# EAGLE design bbb-audiocape (EAGLE 6.1)
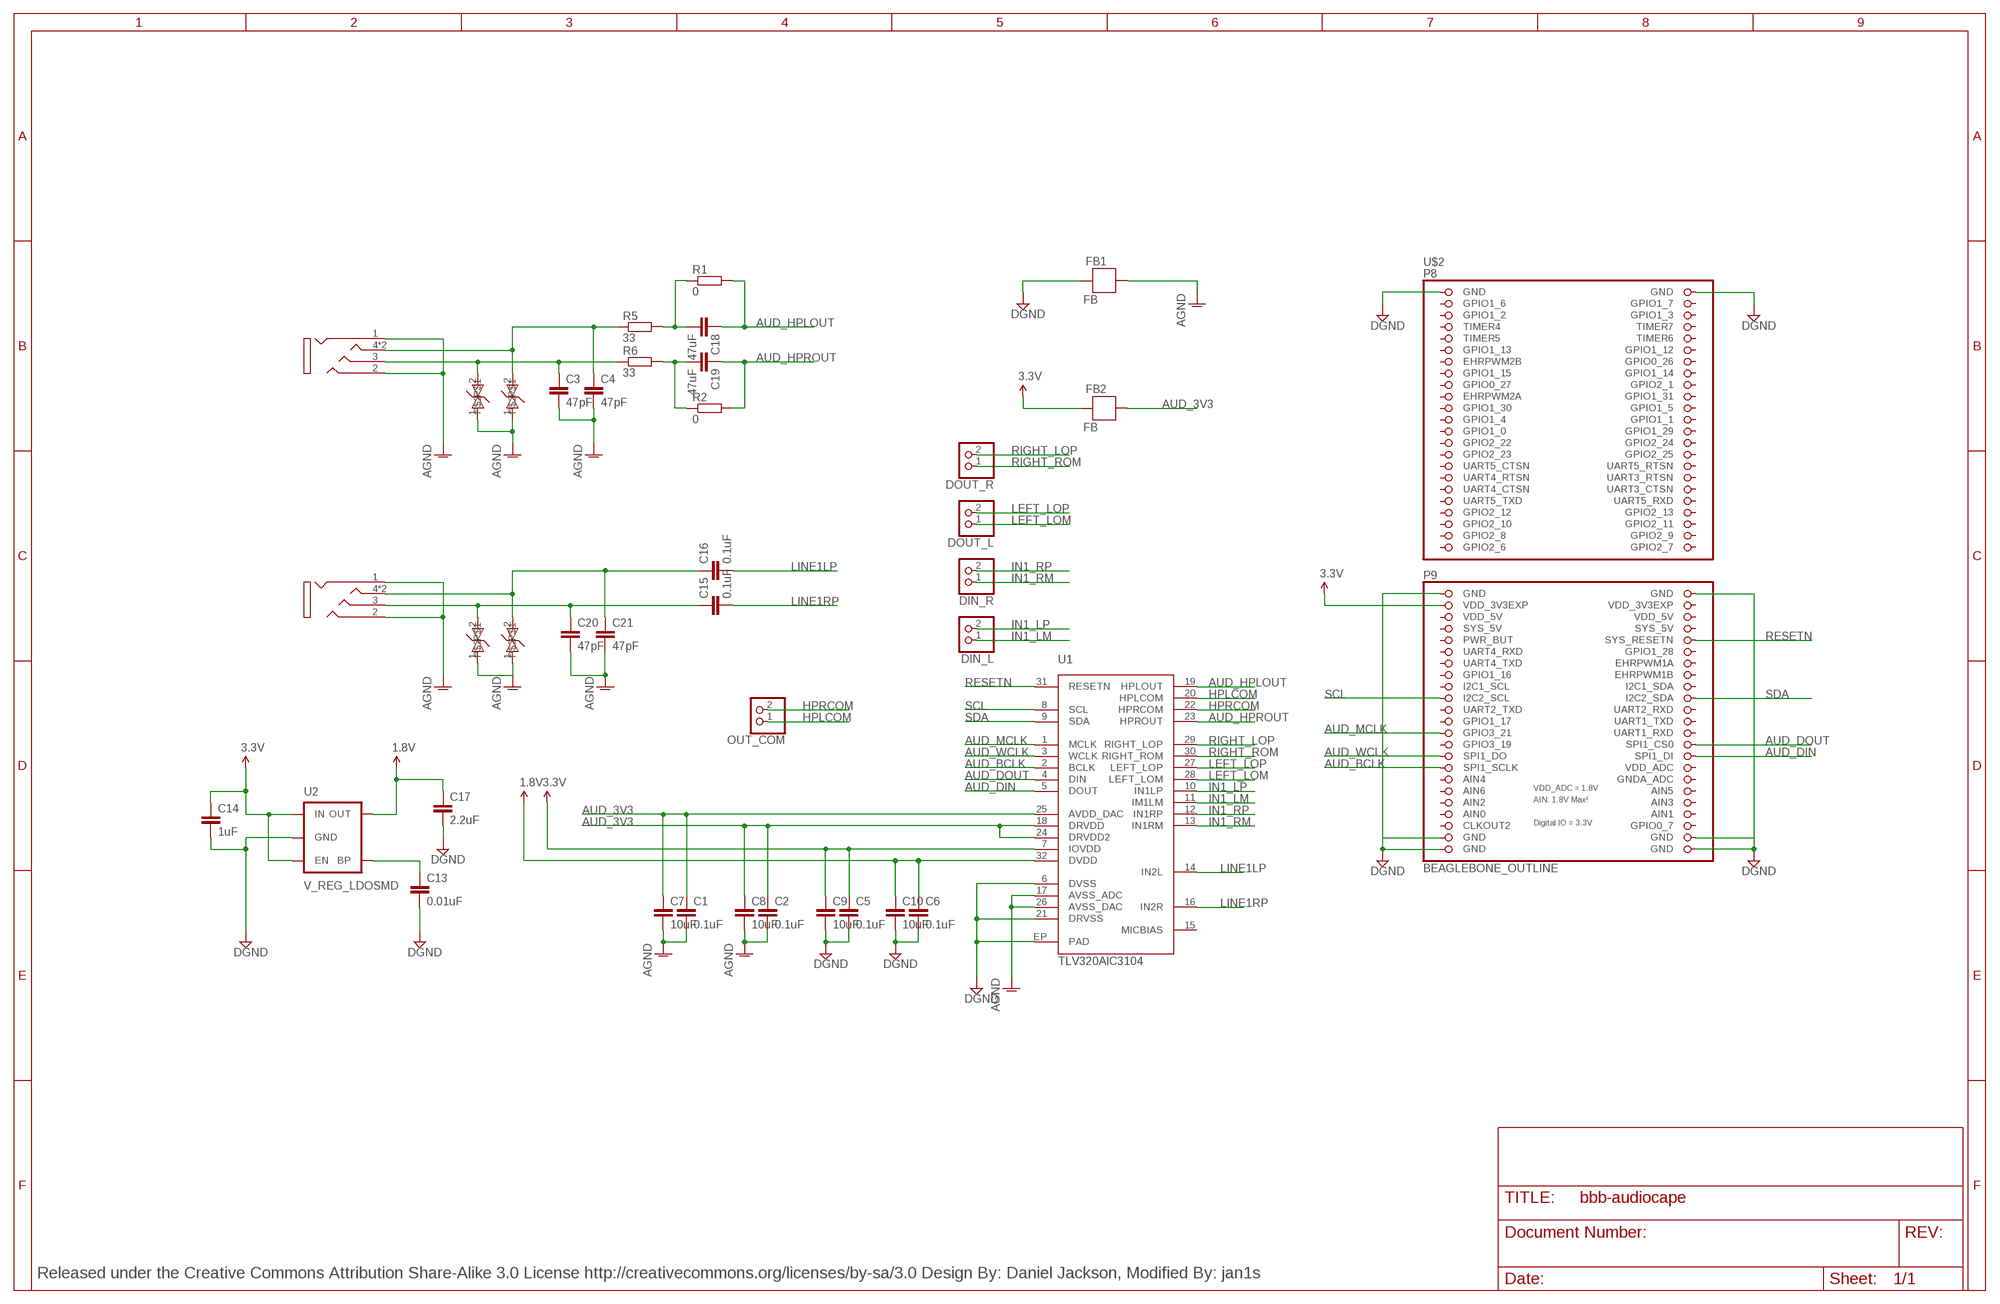
[diagram p0: schematic, sheet 1]

## Parts
C1  0.1uF  C-EUC0603  [C0603]
C2  0.1uF  C-EUC0603  [C0603]
C3  47pF  C-EUC0603  [C0603]
C4  47pF  C-EUC0603  [C0603]
C5  0.1uF  C-EUC0603  [C0603]
C6  0.1uF  C-EUC0603  [C0603]
C7  10uF  C-EUC0603  [C0603]
C8  10uF  C-EUC0603  [C0603]
C9  10uF  C-EUC0603  [C0603]
C10  10uF  C-EUC0603  [C0603]
C13  0.01uF  C-EUC0603  [C0603]
C14  1uF  C-EUC0603  [C0603]
C15  0.1uF  C-EUC0603  [C0603]
C16  0.1uF  C-EUC0603  [C0603]
C17  2.2uF  C-EUC0603  [C0603]
C18  47uF  C-EUC1206  [C1206]
C19  47uF  C-EUC1206  [C1206]
C20  47pF  C-EUC0603  [C0603]
C21  47pF  C-EUC0603  [C0603]
D1  PGB0010603MR  [0603]
D2  PGB0010603MR  [0603]
D3  PGB0010603MR  [0603]
D4  PGB0010603MR  [0603]
DIN_L  HEADER-1X2ROUND  [1X02_ROUND]
DIN_R  HEADER-1X2ROUND  [1X02_ROUND]
DOUT_L  HEADER-1X2ROUND  [1X02_ROUND]
DOUT_R  HEADER-1X2ROUND  [1X02_ROUND]
FB1  FB  [0603]
FB2  FB  [0603]
OUT_COM  HEADER-1X2ROUND  [1X02_ROUND]
R1  0  R-EU_R0603  [R0603]
R2  0  R-EU_R0603  [R0603]
R5  33  R-EU_R0603  [R0603]
R6  33  R-EU_R0603  [R0603]
U1  TLV320AIC3104  [QFN-32]
U2  V_REG_LDOSMD  [SOT23-5]
U$2  BEAGLEBONE_OUTLINE  [BEAGLEBONE_SHIELD]
U$3  1503_13  [1503-03]
U$5  1503_13  [1503-03]

## Nets
1.8V: C6.1 C10.1 C17.1 U1.32(DVDD) U2.5(OUT)
3.3V: C5.1 C9.1 C14.1 FB2.2 U1.7(IOVDD) U2.1(IN) U2.3(EN) U$2.49(VDD_3V3EXP)
AGND: C1.2 C2.2 C3.2 C4.2 C7.2 C8.2 C20.2 C21.2 D1.1 D2.1 D3.1 D4.1 FB1.1 U1.17(AVSS_ADC) U1.26(AVSS_DAC) U$3.1 U$3.2 U$5.1 U$5.2
AUD_3V3: C1.1 C2.1 C7.1 C8.1 FB2.1 U1.18(DRVDD) U1.24(DRVDD2) U1.25(AVDD_DAC)
AUD_BCLK: U1.2(BCLK) U$2.77(SPI1_SCLK)
AUD_DIN: U1.5(DOUT) U$2.76(SPI1_DI)
AUD_DOUT: U1.4(DIN) U$2.74(SPI1_CS0)
AUD_HPLOUT: C18.1 R1.2 U1.19(HPLOUT)
AUD_HPROUT: C19.1 R2.2 U1.23(HPROUT)
AUD_MCLK: U1.1(MCLK) U$2.71(GPIO3_21)
AUD_WCLK: U1.3(WCLK) U$2.75(SPI1_DO)
DGND: C5.2 C6.2 C9.2 C10.2 C13.2 C14.2 C17.2 FB1.2 U1.6(DVSS) U1.21(DRVSS) U1.EP(PAD) U2.2(GND) U$2.1(GND) U$2.2(GND) U$2.47(GND) U$2.48(GND) U$2.89(GND) U$2.90(GND) U$2.91(GND) U$2.92(GND)
HPLCOM: OUT_COM.1 U1.20(HPLCOM)
HPRCOM: OUT_COM.2 U1.22(HPRCOM)
IN1_LM: DIN_L.1 U1.11(IM1LM)
IN1_LP: DIN_L.2 U1.10(IN1LP)
IN1_RM: DIN_R.1 U1.13(IN1RM)
IN1_RP: DIN_R.2 U1.12(IN1RP)
J1: C4.1 D2.2 R5.1 U$3.4 U$3.4-2
LEFT_LOM: DOUT_L.1 U1.28(LEFT_LOM)
LEFT_LOP: DOUT_L.2 U1.27(LEFT_LOP)
LINE1LP: C16.2 U1.14(IN2L)
LINE1RP: C15.2 U1.16(IN2R)
N$1: C15.1 C20.1 D3.2 U$5.3
N$3: C18.2 R1.1 R5.2
N$4: C19.2 R2.1 R6.2
N$5: C3.1 D1.2 R6.1 U$3.3
N$6: C16.1 C21.1 D4.2 U$5.4 U$5.4-2
N$7: C13.1 U2.4(BP)
RESETN: U1.31(RESETN) U$2.56(SYS_RESETN)
RIGHT_LOP: DOUT_R.2 U1.29(RIGHT_LOP)
RIGHT_ROM: DOUT_R.1 U1.30(RIGHT_ROM)
SCL: U1.8(SCL) U$2.65(I2C2_SCL)
SDA: U1.9(SDA) U$2.66(I2C2_SDA)
Unconnected: U1.15(MICBIAS) U$2.3(GPIO1_6) U$2.4(GPIO1_7) U$2.5(GPIO1_2) U$2.6(GPIO1_3) U$2.7(TIMER4) U$2.8(TIMER7) U$2.9(TIMER5) U$2.10(TIMER6) U$2.11(GPIO1_13) U$2.12(GPIO1_12) U$2.13(EHRPWM2B) U$2.14(GPIO0_26) U$2.15(GPIO1_15) U$2.16(GPIO1_14) U$2.17(GPIO0_27) U$2.18(GPIO2_1) U$2.19(EHRPWM2A) U$2.20(GPIO1_31) U$2.21(GPIO1_30) U$2.22(GPIO1_5) U$2.23(GPIO1_4) U$2.24(GPIO1_1) U$2.25(GPIO1_0) U$2.26(GPIO1_29) U$2.27(GPIO2_22) U$2.28(GPIO2_24) U$2.29(GPIO2_23) U$2.30(GPIO2_25) U$2.31(UART5_CTSN) U$2.32(UART5_RTSN) U$2.33(UART4_RTSN) U$2.34(UART3_RTSN) U$2.35(UART4_CTSN) U$2.36(UART3_CTSN) U$2.37(UART5_TXD) U$2.38(UART5_RXD) U$2.39(GPIO2_12) U$2.40(GPIO2_13) U$2.41(GPIO2_10) U$2.42(GPIO2_11) U$2.43(GPIO2_8) U$2.44(GPIO2_9) U$2.45(GPIO2_6) U$2.46(GPIO2_7) U$2.55(PWR_BUT) U$2.57(UART4_RXD) U$2.58(GPIO1_28) U$2.59(UART4_TXD) U$2.60(EHRPWM1A) U$2.61(GPIO1_16) U$2.62(EHRPWM1B) U$2.63(I2C1_SCL) U$2.64(I2C1_SDA) U$2.67(UART2_TXD) U$2.68(UART2_RXD) U$2.69(GPIO1_17) U$2.70(UART1_TXD) U$2.72(UART1_RXD) U$2.73(GPIO3_19) U$2.79(AIN4) U$2.81(AIN6) U$2.82(AIN5) U$2.83(AIN2) U$2.84(AIN3) U$2.85(AIN0) U$2.86(AIN1) U$2.87(CLKOUT2) U$2.88(GPIO0_7)

## Notes on the sheet
- Released under the Creative Commons Attribution Share-Alike 3.0 License http://creativecommons.org/licenses/by-sa/3.0 Design By: Daniel Jackson, Modified By: jan1s

## Power pins joined to a net without a drawn wire
GNDA_ADC: U$2.80(GNDA_ADC)
SYS_5V: U$2.53(SYS_5V) U$2.54(SYS_5V)
VDD_3V3EXP: U$2.50(VDD_3V3EXP)
VDD_5V: U$2.51(VDD_5V) U$2.52(VDD_5V)
VDD_ADC: U$2.78(VDD_ADC)

## Library data of the parts
C1-C10 C13-C21 = rcl:C-EU: CAPACITOR, European symbol
D1-D4 = CircuitCo:PGB0010603MR; MANEX: 130-0001371
DIN_L DIN_R DOUT_L DOUT_R OUT_COM = microbuilder:HEADER-1X2: PIN HEADER
FB1 FB2 = SparkFun-Passives:FB; MANEX: 126-0001418
R1 R2 R5 R6 = rcl:R-EU_: RESISTOR, European symbol
U1 = CircuitCo:TLV320AIC3104; MANEX: 140-0004277
U2 = SparkFun-PowerIC:V_REG_LDO: Voltage Regulator LDO Standard 150mA LDO voltage regulator in SOT-23 layout. Micrel part MIC5205. BP (by-pass) pin is used to lower output noise with 470pF cap.; MANEX: 140-0001616
U$2 = microbuilder:BEAGLEBONE_OUTLINE
U$3 U$5 = con-lumberg:1503_13

## Board
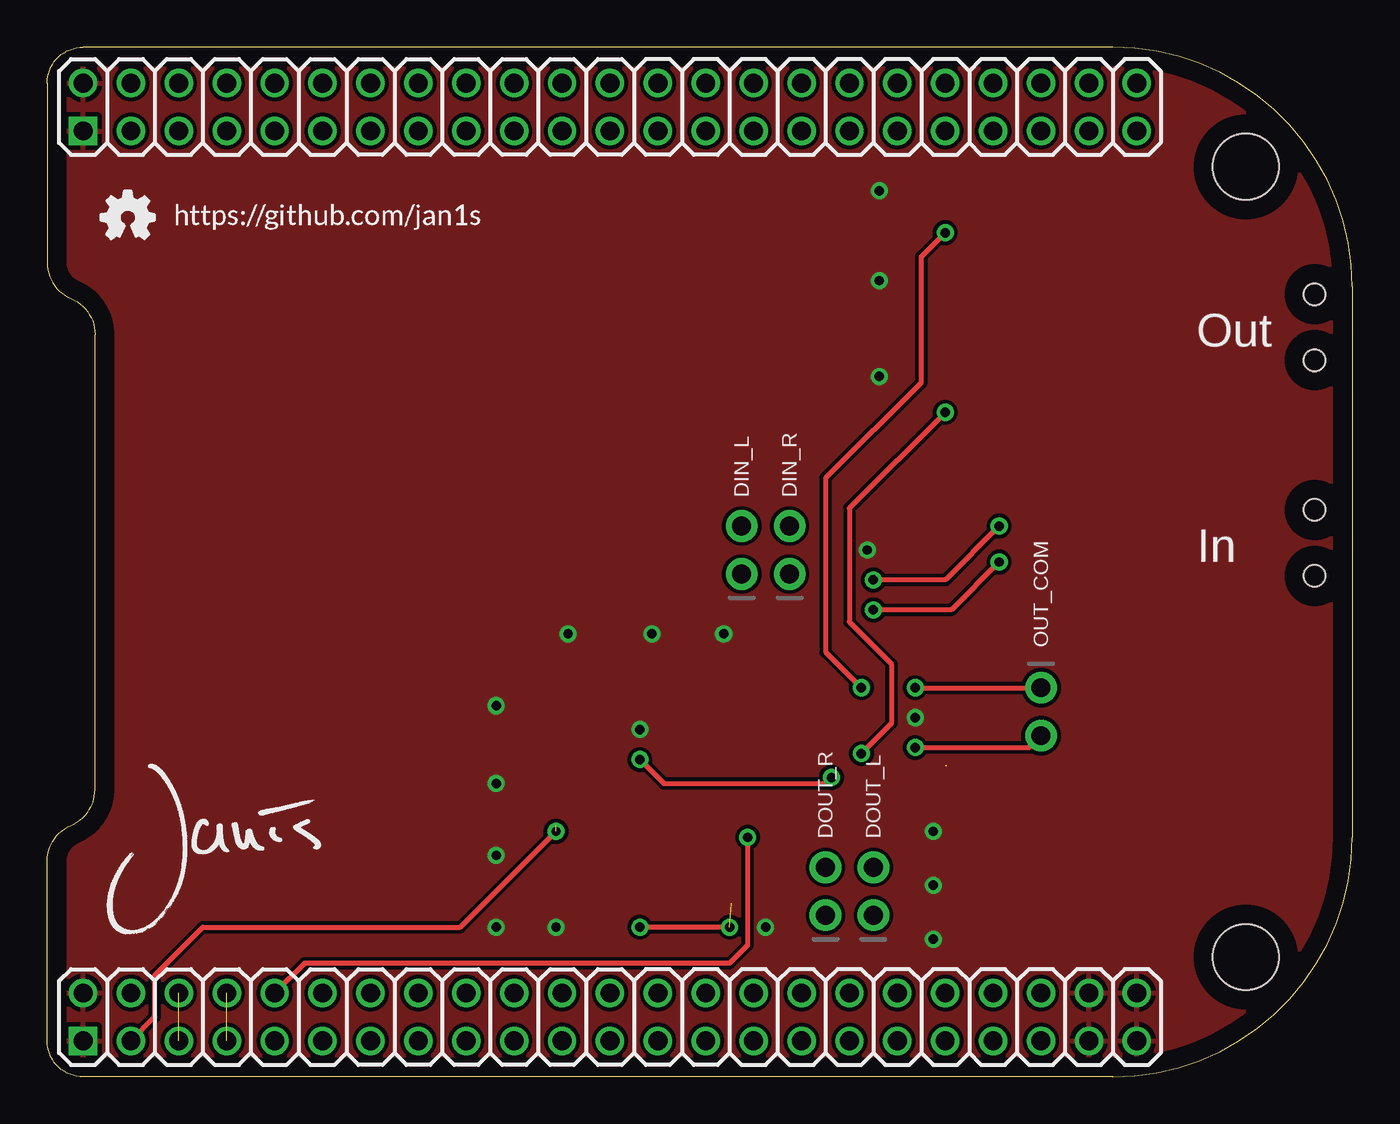
[diagram p1: board, top side]
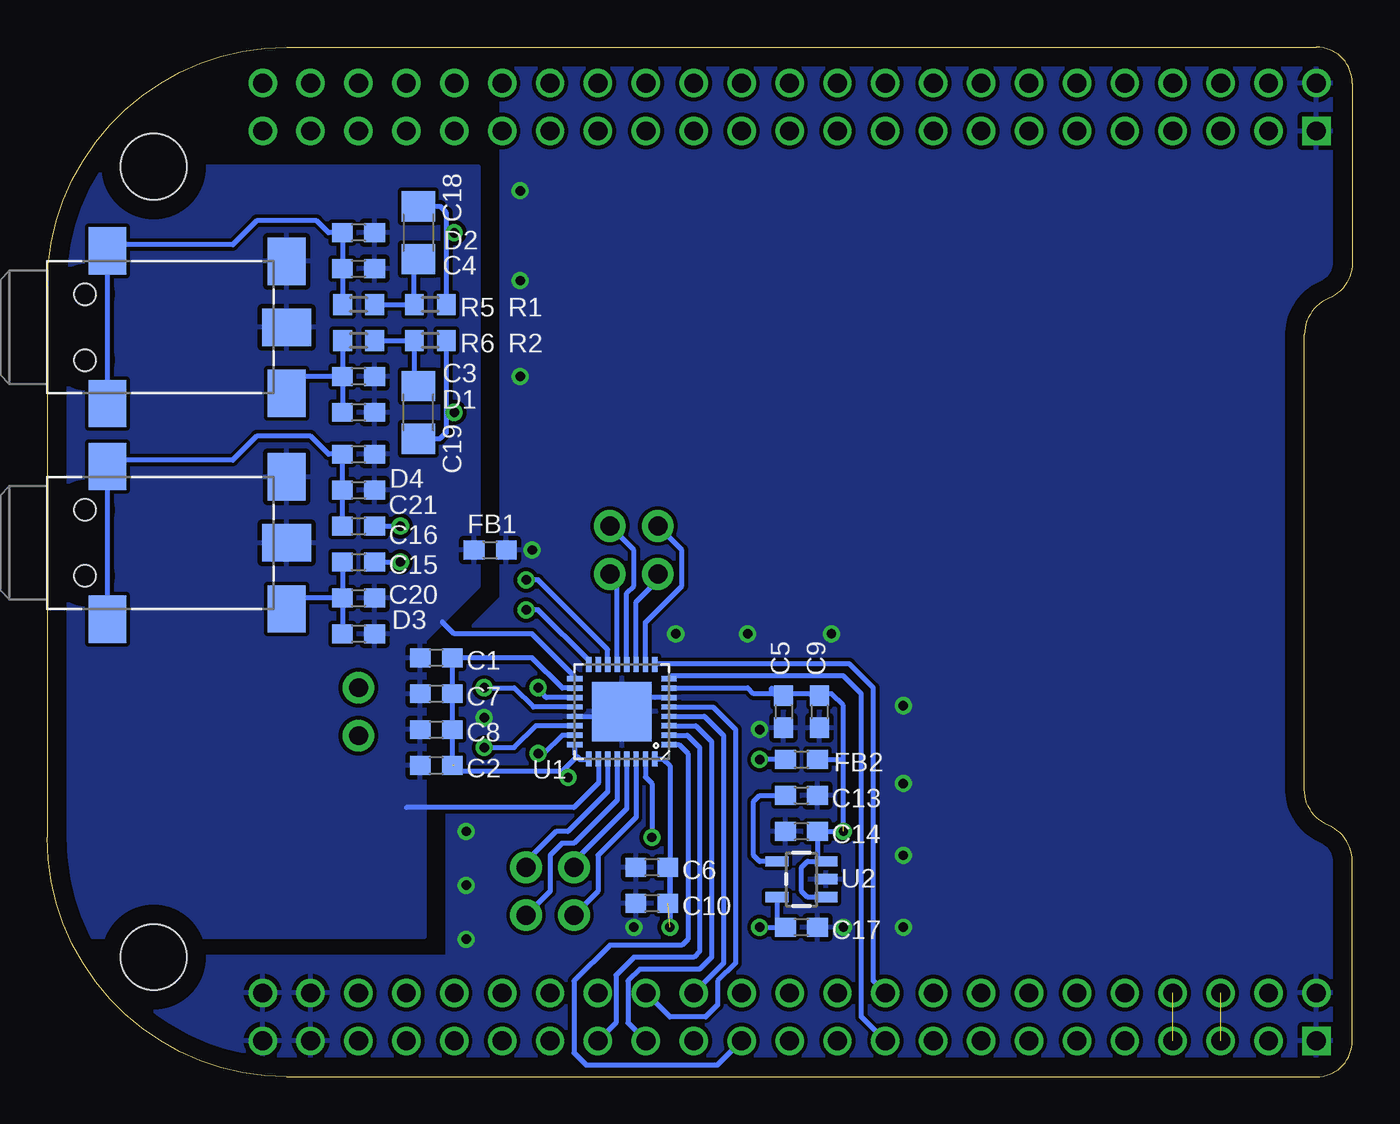
[diagram p2: board, bottom side, seen from below]

Size 69.22 x 54.61 mm. Coordinates in mm from the lower left corner, seen from the top.
Copper layers (1*16): Top 0.035mm / dielectric 1.5mm / Bottom 0.035mm
Design rules: minimum track width 10mil, minimum drill 24mil, track to track 8mil, track to pad 8mil, pad to pad 8mil, via to via 8mil, smd to smd 8mil, copper to edge 40mil, drill to drill 8mil, minimum pad ring 10mil, minimum via ring 8mil, stop-mask expansion 4mil, vias tented up to drill 0mil, thermal gap 10mil

### Footprints (pad centres in the part's own frame; a part is rotated, then mirrored left to right if it is on the bottom)
C0603 = smd 1.1 x 1: 1 -0.85,0; 2 0.85,0
C1206 = smd 1.6 x 1.8: 1 -1.4,0; 2 1.4,0
0603 = smd 1.1 x 1: 1 -0.85,0; 2 0.85,0
1X02_ROUND = drill 1 pad 1.676: 1 -1.27,0; 2 1.27,0
R0603 = smd 1 x 1.1: 1 -0.85,0; 2 0.85,0
QFN-32 = smd 0.285 x 0.8: 1 -1.75,-2.5; 2 -1.25,-2.5; 3 -0.75,-2.5; 4 -0.25,-2.5; 5 0.25,-2.5; 6 0.75,-2.5; 7 1.25,-2.5; 8 1.75,-2.5; 17 1.75,2.5; 18 1.25,2.5; 19 0.75,2.5; 20 0.25,2.5; 21 -0.25,2.5; 22 -0.75,2.5; 23 -1.25,2.5; 24 -1.75,2.5 | smd 0.8 x 0.285: 9 2.5,-1.75; 10 2.5,-1.25; 11 2.5,-0.75; 12 2.5,-0.25; 13 2.5,0.25; 14 2.5,0.75; 15 2.5,1.25; 16 2.5,1.75; 25 -2.5,1.75; 26 -2.5,1.25; 27 -2.5,0.75; 28 -2.5,0.25; 29 -2.5,-0.25; 30 -2.5,-0.75; 31 -2.5,-1.25; 32 -2.5,-1.75 | smd 3.15 x 3.15: EP 0,0
SOT23-5 = smd 0.55 x 1.2: 1 -0.95,-1.3; 2 0,-1.3; 3 0.95,-1.3; 4 0.95,1.3; 5 -0.95,1.3
BEAGLEBONE_SHIELD = drill 1 square: 1 4.445,19.05; 47 52.705,19.05 | drill 1: 2 1.905,19.05; 3 4.445,21.59; 4 1.905,21.59; 5 4.445,24.13; 6 1.905,24.13; 7 4.445,26.67; 8 1.905,26.67; 9 4.445,29.21; 10 1.905,29.21; 11 4.445,31.75; 12 1.905,31.75; 13 4.445,34.29; 14 1.905,34.29; 15 4.445,36.83; 16 1.905,36.83; 17 4.445,39.37; 18 1.905,39.37; 19 4.445,41.91; 20 1.905,41.91; 21 4.445,44.45; 22 1.905,44.45; 23 4.445,46.99; 24 1.905,46.99; 25 4.445,49.53; 26 1.905,49.53; 27 4.445,52.07; 28 1.905,52.07; 29 4.445,54.61; 30 1.905,54.61; 31 4.445,57.15; 32 1.905,57.15; 33 4.445,59.69; 34 1.905,59.69; 35 4.445,62.23; 36 1.905,62.23; 37 4.445,64.77; 38 1.905,64.77; 39 4.445,67.31; 40 1.905,67.31; 41 4.445,69.85; 42 1.905,69.85; 43 4.445,72.39; 44 1.905,72.39; 45 4.445,74.93; 46 1.905,74.93; 48 50.165,19.05; 49 52.705,21.59; 50 50.165,21.59; 51 52.705,24.13; 52 50.165,24.13; 53 52.705,26.67; 54 50.165,26.67; 55 52.705,29.21; 56 50.165,29.21; 57 52.705,31.75; 58 50.165,31.75; 59 52.705,34.29; 60 50.165,34.29; 61 52.705,36.83; 62 50.165,36.83; 63 52.705,39.37; 64 50.165,39.37; 65 52.705,41.91; 66 50.165,41.91; 67 52.705,44.45; 68 50.165,44.45; 69 52.705,46.99; 70 50.165,46.99; 71 52.705,49.53; 72 50.165,49.53; 73 52.705,52.07; 74 50.165,52.07; 75 52.705,54.61; 76 50.165,54.61; 77 52.705,57.15; 78 50.165,57.15; 79 52.705,59.69; 80 50.165,59.69; 81 52.705,62.23; 82 50.165,62.23; 83 52.705,64.77; 84 50.165,64.77; 85 52.705,67.31; 86 50.165,67.31; 87 52.705,69.85; 88 50.165,69.85; 89 52.705,72.39; 90 50.165,72.39; 91 52.705,74.93; 92 50.165,74.93 | hole 3.5: 6.35,80.71; 48.26,80.71
1503-03 = smd 2.6 x 2: 1 12.7,0 | smd 2 x 2.5: 2 12.7,3.5; 3 12.7,-3.5; 4 3.2,4.05; 4-2 3.2,-4.05 | hole 1.15: 2,-1.75; 2,1.75

### Placement (x,y rotation side)
C1  48.58,22.22 180 bottom
C2  48.58,16.51 180 bottom
C3  52.71,37.15 0 bottom
C4  52.71,42.86 0 bottom
C5  30.16,19.37 270 bottom
C6  37.15,11.11 180 bottom
C7  48.58,20.32 180 bottom
C8  48.58,18.41 180 bottom
C9  28.26,19.37 270 bottom
C10  37.15,9.21 180 bottom
C13  29.21,14.92 0 bottom
C14  29.21,13.02 180 bottom
C15  52.71,27.3 0 bottom
C16  52.71,29.21 0 bottom
C17  29.21,7.94 0 bottom
C18  49.53,44.77 270 bottom
C19  49.53,35.24 90 bottom
C20  52.71,25.4 0 bottom
C21  52.71,31.11 0 bottom
D1  52.71,35.24 180 bottom
D2  52.71,44.77 180 bottom
D3  52.71,23.49 180 bottom
D4  52.71,33.02 180 bottom
DIN_L  36.83,27.94 90 top
DIN_R  39.37,27.94 90 top
DOUT_L  43.81,9.84 90 top
DOUT_R  41.27,9.84 90 top
FB1  45.72,27.94 0 bottom
FB2  29.21,16.83 0 bottom
OUT_COM  52.71,19.37 270 top
R1  48.9,40.96 0 bottom
R2  48.9,39.05 0 bottom
R5  52.71,40.96 0 bottom
R6  52.71,39.05 0 bottom
U1  38.73,19.37 90 bottom
U2  29.21,10.48 90 bottom
U$1  [GITHUB/JAN1S]  6.67,45.08 0 top
U$2  -17.14,54.61 270 top
U$3  69.22,39.75 0 bottom
U$4  [JANIS_10MM]  2.86,7.3 0 top
U$5  69.22,28.32 0 bottom
U$6  [OSHW_FILLX100_NOTEXT]  2.86,44.45 0 top

### Tracks (layer width: path | path; a pad name or v marks a point on that pad's centre or on a via)
1.8V  (via drill 0.5)  (1 unrouted)
  Top 0.254: v36.2,7.94 v31.43,7.94
  Bottom 0.254: 36.51,11.11 C6.1 36.2,11.01 36.2,9.21 C10.1 | U1.32 36.55,16.87 36.2,16.51 v36.2,7.94 | v31.43,7.94 C17.1 30.51,8.39 U2.5
3.3V  (via drill 0.5)  (1 unrouted)
  Top 0.254: U$2.49 5.71,3.17 5.71,5.4 8.26,7.94 21.91,7.94 v26.99,13.02
  Bottom 0.254: 30.8,20.32 30.8,20.62 | 28.26,11.43 28.89,11.43 29.21,11.11 29.21,9.84 28.9,9.53 U2.1 | 27.94,11.43 U2.3 27.94,11.43 | 28.26,11.43 28.36,11.53 C14.1 27.3,13.02 26.99,13.33 26.99,16.83 | 28.26,11.43 27.94,11.43 | 26.99,16.83 26.99,19.68 27.62,20.32 28.79,20.32 C9.1 28.89,20.32 30.7,20.32 C5.1 30.8,20.32 | 30.8,20.32 31.75,20.32 32.05,20.62 | 32.05,20.62 32.07,20.64 | U1.7 32.05,20.62 | FB2.2 26.99,16.83
AGND
  Bottom 0.254: U1.17 41.23,21.23 43.5,23.49 47.63,23.49 48.26,24.13 | U1.26 39.98,15.58 41.27,14.29 50.16,14.29
  pour Bottom: 46.35,48.26 46.35,26.03 49.21,23.18 49.21,7.43 69.22,7.43 69.22,48.26
AUD_3V3  (via drill 0.5)  (1 unrouted)
  Top 0.254: v31.43,16.83 32.7,15.56 41.27,15.56 v41.59,15.87
  Bottom 0.254: U1.24 41.23,17.1 41.12,16.99 | 41.12,16.99 40.96,16.83 40.52,16.83 U1.25 | 41.91,16.19 41.12,16.99 | C2.1 C8.1 C7.1 C1.1 43.5,22.22 41.89,20.62 U1.18 | 41.91,16.19 47.31,16.19 47.63,16.51 | FB2.1 v31.43,16.83 | v41.59,15.87 41.91,16.19
AUD_BCLK
  Bottom 0.254: U1.2 35.26,18.12 34.61,17.46 34.61,6.67 34.93,6.35 38.1,6.35 39.05,5.4 39.05,2.86 U$2.77
AUD_DIN
  Bottom 0.254: U1.5 33.91,19.62 32.7,18.41 32.7,6.03 33.66,5.08 33.66,3.81 34.29,3.17 36.2,3.17 U$2.76
AUD_DOUT
  Bottom 0.254: U1.4 34.36,19.12 33.34,18.1 33.34,6.03 U$2.74
AUD_HPLOUT  (via drill 0.5)
  Top 0.254: v47.63,44.77 46.35,43.5 46.35,36.83 41.27,31.75 41.27,22.54 v43.18,20.64
  Bottom 0.254: R1.2 48.04,44.77 | 48.04,44.77 48.04,45.82 48.39,46.17 C18.1 | v47.63,44.77 48.04,44.77 | U1.19 42.75,20.12 v43.18,20.64
AUD_HPROUT  (via drill 0.5)
  Top 0.254: v47.63,35.24 42.55,30.16 42.55,24.13 44.77,21.91 44.77,18.73 v43.18,17.14
  Bottom 0.254: C19.1 48.39,33.84 48.04,34.19 48.04,35.24 | 48.04,35.24 R2.2 | v47.63,35.24 48.04,35.24 | U1.23 41.89,18.12 42.86,17.14 v43.18,17.14
AUD_MCLK
  Bottom 0.254: U1.1 35.72,17.62 35.24,17.14 35.24,7.3 35.56,6.98 39.37,6.98 41.27,5.08 41.27,1.27 40.64,0.63 33.66,0.63 U$2.71
AUD_WCLK
  Bottom 0.254: U1.3 34.81,18.62 33.97,17.78 33.97,6.35 34.61,5.71 37.78,5.71 38.42,5.08 38.42,2.86 U$2.75
DGND  (via drill 0.5)
  Bottom 0.254: U1.6 37.98,20.12 U1.EP 38.98,19.12 U1.21
  other vias: 46.04,19.05 26.99,7.94 31.43,18.41 38.1,7.94 43.5,27.94 35.88,23.49 46.99,13.02 46.99,7.3 46.99,10.16 44.13,37.15 44.13,46.99 44.13,42.23 32.07,23.49 27.62,23.49 23.81,19.68 23.81,15.56 23.81,11.75 23.81,7.94
  pour Top: -3.17,57.15 -3.17,-2.54 73.03,-2.54 73.03,57.15
  pour Bottom: -1.9,-3.81 47.94,-3.81 47.94,22.54 45.09,25.4 45.09,58.42 -1.9,58.42
  pour Bottom: 44.13,6.35 69.22,6.35 69.22,-6.35 44.13,-6.35
HPLCOM  (via drill 0.5)
  Top 0.254: v46.04,20.64 OUT_COM.1
  Bottom 0.254: U1.20 43.43,19.62 44.45,20.64 v46.04,20.64
HPRCOM  (via drill 0.5)
  Top 0.254: v46.04,17.46 52.07,17.46 OUT_COM.2
  Bottom 0.254: U1.22 43.3,18.62 44.45,17.46 v46.04,17.46
IN1_LM
  Bottom 0.254: U1.11 37.98,25.2 36.83,26.35 DIN_L.1
IN1_LP
  Bottom 0.254: U1.10 37.48,24.11 35.56,26.03 35.56,27.94 DIN_L.2
IN1_RM
  Bottom 0.254: U1.13 38.98,26.28 DIN_R.1
IN1_RP
  Bottom 0.254: U1.12 38.48,25.65 38.1,26.03 38.1,27.94 DIN_R.2
J1
  Bottom 0.254: R5.1 C4.1 D2.2 54.29,44.77 54.93,45.4 58.1,45.4 59.37,44.13 65.68,44.13 U$3.4 U$3.4-2
LEFT_LOM
  Bottom 0.254: U1.28 38.98,14.67 41.27,12.38 41.91,12.38 42.55,11.75 42.55,9.84 DOUT_L.1
LEFT_LOP
  Bottom 0.254: U1.27 39.48,15.12 41.59,13.02 42.23,13.02 43.81,11.43 DOUT_L.2
LINE1LP  (via drill 0.5)
  Top 0.254: v50.48,29.21 47.63,26.35 v43.81,26.35
  Bottom 0.254: C16.2 v50.48,29.21 | U1.14 39.48,22.66 43.18,26.35 v43.81,26.35
LINE1RP  (via drill 0.5)
  Top 0.254: v50.48,27.3 47.94,24.76 v43.81,24.76
  Bottom 0.254: C15.2 v50.48,27.3 | U1.16 40.48,22.07 43.18,24.76 v43.81,24.76
N$1
  Bottom 0.254: C15.1 C20.1 | C20.1 D3.2 | C20.1 55.94,25.4 U$5.3
N$3
  Bottom 0.254: R5.2 R1.1 49.74,43.15 C18.2
N$4
  Bottom 0.254: R6.2 R2.1 49.74,36.86 C19.2
N$5
  Bottom 0.254: R6.1 C3.1 | C3.1 D1.2 | C3.1 55.62,37.15 U$3.3
N$6
  Bottom 0.254: C16.1 C21.1 D4.2 54.29,33.02 55.24,33.97 58.1,33.97 59.37,32.7 65.68,32.7 U$5.4 U$5.4-2
N$7
  Bottom 0.254: U2.4 31.43,11.43 31.75,11.75 31.75,14.6 31.43,14.92 C13.1
RESETN  (via drill 0.5)
  Top 0.254: v37.15,12.7 37.15,6.98 36.2,6.03 13.65,6.03 U$2.56
  Bottom 0.254: U1.31 37.48,15.89 37.15,15.56 v37.15,12.7
RIGHT_LOP
  Bottom 0.254: U1.29 38.48,14.22 41.27,11.43 DOUT_R.2
RIGHT_ROM
  Bottom 0.254: U1.30 37.98,13.77 40.01,11.75 40.01,9.84 DOUT_R.1
SCL
  Bottom 0.254: U$2.65 26.04,3.17 26.04,20.32 26.99,21.27 36.08,21.27 U1.8
SDA
  Bottom 0.254: U$2.66 25.4,5.08 25.4,20.64 26.67,21.91 36.95,21.91 U1.9
SYS_5V  (1 unrouted)
VDD_5V  (1 unrouted)

### Text on the board
tNames: Out | In